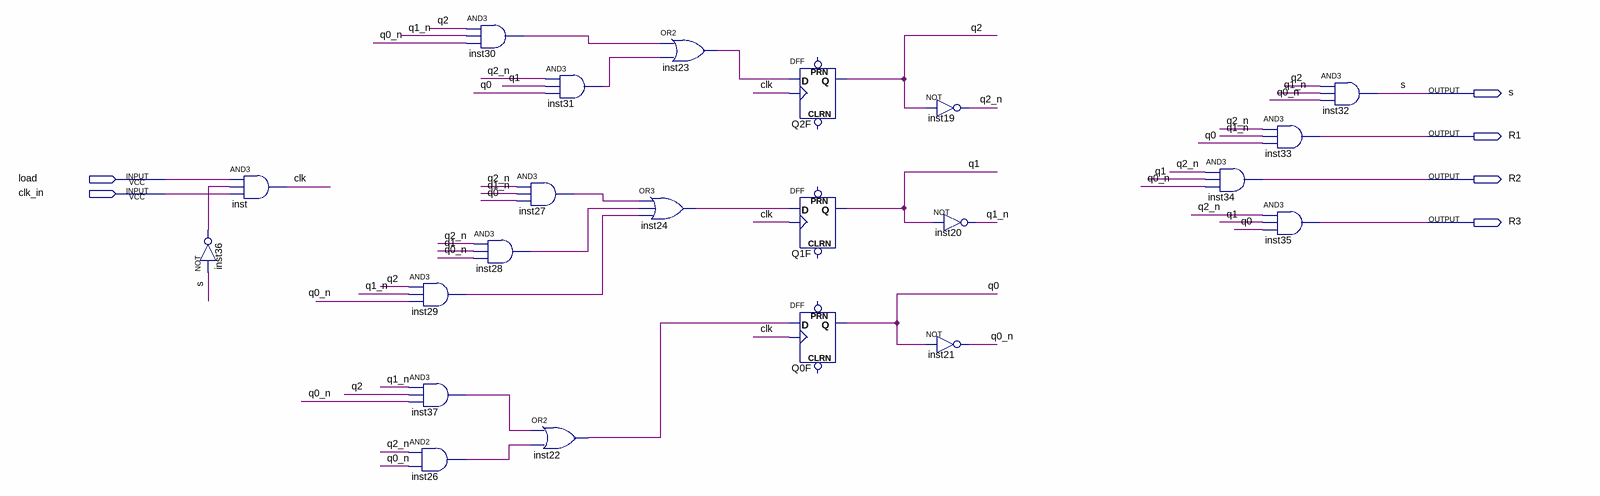
[diagram p0: schematic sheet]
// Quartus schematic Maquina_Estados_Carga.bdf as structural Verilog: 22 symbols, 6 pins
module Maquina_Estados_Carga (
  input  load,
  input  clk_in,
  output s,
  output R1,
  output R2,
  output R3
);

  wire clk, inst22_out, inst23_out, inst24_out, inst26_out, inst27_out, inst28_out, inst29_out, inst30_out,
       inst31_out, inst36_out, inst37_out, q0, q0_n, q1, q1_n, q2, q2_n;

  and inst (clk, load, inst36_out, clk_in);
  not inst36 (inst36_out, s);
  and inst29 (inst29_out, q2, q1_n, q0_n);
  and inst37 (inst37_out, q1_n, q2, q0_n);
  and inst26 (inst26_out, q2_n, q0_n);
  and inst30 (inst30_out, q2, q1_n, q0_n);
  and inst27 (inst27_out, q2_n, q1_n, q0);
  and inst28 (inst28_out, q2_n, q1, q0_n);
  and inst31 (inst31_out, q2_n, q1, q0);
  or inst22 (inst22_out, inst37_out, inst26_out);
  or inst24 (inst24_out, inst27_out, inst28_out, inst29_out);
  or inst23 (inst23_out, inst30_out, inst31_out);
  DFF Q2F (.CLK(clk), .D(inst23_out), .Q(q2));  // open: CLRN, PRN
  DFF Q1F (.CLK(clk), .D(inst24_out), .Q(q1));  // open: CLRN, PRN
  DFF Q0F (.CLK(clk), .D(inst22_out), .Q(q0));  // open: CLRN, PRN
  not inst19 (q2_n, q2);
  not inst21 (q0_n, q0);
  not inst20 (q1_n, q1);
  and inst34 (R2, q2_n, q1, q0_n);
  and inst33 (R1, q2_n, q1_n, q0);
  and inst35 (R3, q2_n, q1, q0);
  and inst32 (s, q2, q1_n, q0_n);
endmodule
